# Altium schematic sheet GMSK Modem w Proto.SchDoc: GMSK Prototyping Board
size A3; CompanyName: BLUESAT Project; Engineer: Daniel Jedrychowski; Organization: BLUESAT Project; Address1: Room 419; Address2: School of EE&T; Address3: UNSW, NSW 2052; Address4: Australia; DocumentNumber: PAYL0005; SheetNumber: 2; SheetTotal: 2; Description: Connections and external components of a GMSK modem; Version: 1.0
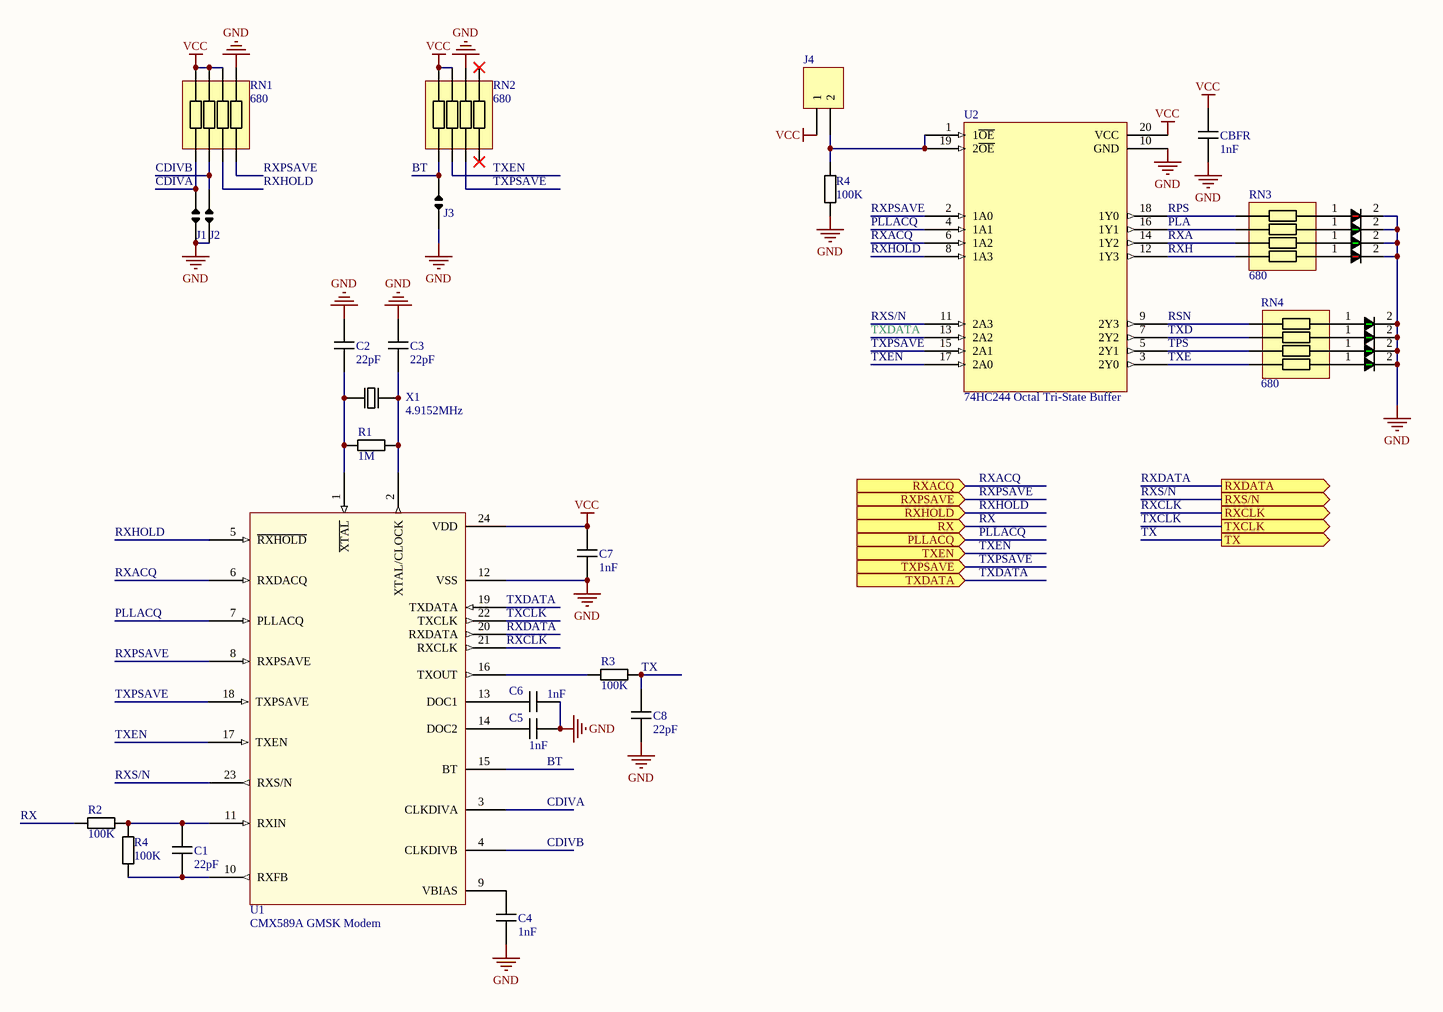
[diagram p0: GMSK Modem w Proto.SchDoc]

## Parts
(Parts that share a designator on the sheet are numbered #1, #2 ... from top to bottom, then left to right.)
C1  value 22pF  [0805 Cap]  (hidden comment: 0805 Cap)
C2  value 22pF  [0805 Cap]  (hidden comment: 0805 Cap)
C3  value 22pF  [0805 Cap]  (hidden comment: 0805 Cap)
C4  value 1nF  [0805 Cap]  (hidden comment: 0805 Cap)
C5  value 1nF  [0805 Cap]  (hidden comment: 0805 Cap)
C6  value 1nF  [0805 Cap]  (hidden comment: 0805 Cap)
C7  value 1nF  [0805 Cap]  (hidden comment: 0805 Cap)
C8  value 22pF  [0805 Cap]  (hidden comment: 0805 Cap)
CBFR  value 1nF  [0805 Cap]  (hidden comment: 0805 Cap)
J1  Jumper  [Solder Jumper C]  (value not drawn)
J2  Jumper  [Solder Jumper C]  (value not drawn)
J3  Jumper  [Solder Jumper C]  (value not drawn)
J4  Header 2  [HDR1X2]  (value not drawn)
PLA1  Green LED  [0603 LED]  (value not drawn)
R1  value 1M  [0805 Resistor]  (hidden comment: 0805 Resistor)
R2  value 100K  [0805 Resistor]  (hidden comment: 0805 Resistor)
R3  value 100K  [0805 Resistor]  (hidden comment: 0805 Resistor)
R4#1  value 100K  [0805 Resistor]  (hidden comment: 0805 Resistor)
R4#2  value 100K  [0805 Resistor]  (hidden comment: 0805 Resistor)
RN1  value 680  [ACAS_0612_AC]  (hidden comment: RN4)
RN2  value 680  [ACAS_0612_AC]  (hidden comment: RN4)
RN3  value 680  [ACAS_0612_AC]  (hidden comment: RN4)
RN4  value 680  [ACAS_0612_AC]  (hidden comment: RN4)
RPS1  Red LED  [0603 LED]  (value not drawn)
RSN1  Green LED  [0603 LED]  (value not drawn)
RXA1  Green LED  [0603 LED]  (value not drawn)
RXH1  Red LED  [0603 LED]  (value not drawn)
TPS1  Green LED  [0603 LED]  (value not drawn)
TXD1  Green LED  [0603 LED]  (value not drawn)
TXE1  Green LED  [0603 LED]  (value not drawn)
U1  CMX589A GMSK Modem  [SOIC24 - GMSK MODEM]
U2  74HC244 Octal Tri-State Buffer  [SOIC20]
X1  value 4.9152MHz  [HC49]  (hidden comment: HC49 Crystal)

## Ports
PLLACQ (in), RX (in), RXACQ (in), RXCLK (out), RXDATA (out), RXHOLD (in), RXPSAVE (in), RXS/N (out), TX (out), TXCLK (out), TXDATA (in), TXEN (in), TXPSAVE (in)

## Nets
GND: C2.2 C3.2 C4.2 C5.2 C6.1 C7.2 C8.2 CBFR.1 J1.1 J2.2 J3.2 PLA1.2 R4#1.1 RN1.1 RN2.6 RPS1.2 RSN1.2 RXA1.2 RXH1.2 TPS1.2 TXD1.2 TXE1.2 U1.12(VSS) U2.10(GND)
VCC: C7.1 CBFR.2 J4.1 RN1.2 RN1.3 RN1.4 RN2.7 RN2.8 U1.24(VDD) U2.20(VCC)
BT: J3.1 RN2.1 U1.15(BT)
CDIVA: J1.2 RN1.5 U1.3(CLKDIVA)
CDIVB: J2.1 RN1.6 U1.4(CLKDIVB)
PLA: RN3.6 U2.16(1Y1)
PLLACQ: U1.7(PLLACQ) U2.4(1A1) ; port PLLACQ
RPS: RN3.5 U2.18(1Y0)
RSN: RN4.5 U2.9(2Y3)
RX: R2.1 ; port RX
RXA: RN3.7 U2.14(1Y2)
RXACQ: U1.6(RXDACQ) U2.6(1A2) ; port RXACQ
RXCLK: U1.21(RXCLK) ; port RXCLK
RXDATA: U1.20(RXDATA) ; port RXDATA
RXH: RN3.8 U2.12(1Y3)
RXHOLD: RN1.7 U1.5(~{RXHOLD}) U2.8(1A3) ; port RXHOLD
RXPSAVE: RN1.8 U1.8(RXPSAVE) U2.2(1A0) ; port RXPSAVE
RXS/N: U1.23(RXS/N) U2.11(2A3) ; port RXS/N
TPS: RN4.7 U2.5(2Y1)
TX: C8.1 R3.2 ; port TX
TXCLK: U1.22(TXCLK) ; port TXCLK
TXD: RN4.6 U2.7(2Y2)
TXDATA: U1.19(TXDATA) U2.13(2A2) ; port TXDATA
TXE: RN4.8 U2.3(2Y0)
TXEN: RN2.2 U1.17(TXEN) U2.17(2A0) ; port TXEN
TXPSAVE: RN2.3 U1.18(TXPSAVE) U2.15(2A1) ; port TXPSAVE
NetC1_1: C1.1 R4#2.2 U1.10(RXFB)
NetC1_2: C1.2 R2.2 R4#2.1 U1.11(RXIN)
NetC2_1: C2.1 R1.1 U1.1(~{XTAL}) X1.1
NetC3_1: C3.1 R1.2 U1.2(XTAL/CLOCK) X1.2
NetC4_1: C4.1 U1.9(VBIAS)
NetC5_1: C5.1 U1.14(DOC2)
NetC6_2: C6.2 U1.13(DOC1)
NetJ4_2: J4.2 R4#1.2 U2.1(1~{OE}) U2.19(2~{OE})
NetPLA1_1: PLA1.1 RN3.3
NetR3_1: R3.1 U1.16(TXOUT)
NetRN3_1: RN3.1 RXH1.1
NetRN3_2: RN3.2 RXA1.1
NetRN3_4: RN3.4 RPS1.1
NetRN4_1: RN4.1 TXE1.1
NetRN4_2: RN4.2 TPS1.1
NetRN4_3: RN4.3 TXD1.1
NetRN4_4: RN4.4 RSN1.1

Not connected (* = marked no-connect by the designer): RN2 4* 5*

## Notes on the sheet
- Title
- Description:
- Size:
- Author:
- Date:
- A3
- Time:
- Version
- Sheet:
- Drawing No.:
- of
- File:

## Library data of the parts
C1-C3 C8 = 0805 MLCC - NP0, 5%
C4-C7 CBFR = 0805 MLCC - X7R, 10%
J1-J3 = Solder Bridge
J4 = Header 2: Header, 2-Pin; LatestRevisionDate: 17-Jul-2002; LatestRevisionNote: Re-released for DXP Platform.; Publisher: Altium Limited
PLA1 RSN1 RXA1 TPS1 TXD1 TXE1 = LED, SMD, GREEN: Chip LED, Green, 0603 Footprint; Farnell Order Number: 1779659
R1-R3 R4#1 R4#2 = 0805 Thin Film Resistor 0.1%
RPS1 RXH1 = LED, SMD, RED: Chip LED, Red, 0603 Footprint; Farnell Order Number: 1779659
U1 = CMX589A
U2 = 74HC244: Octal Non-Inverting Three state buffer